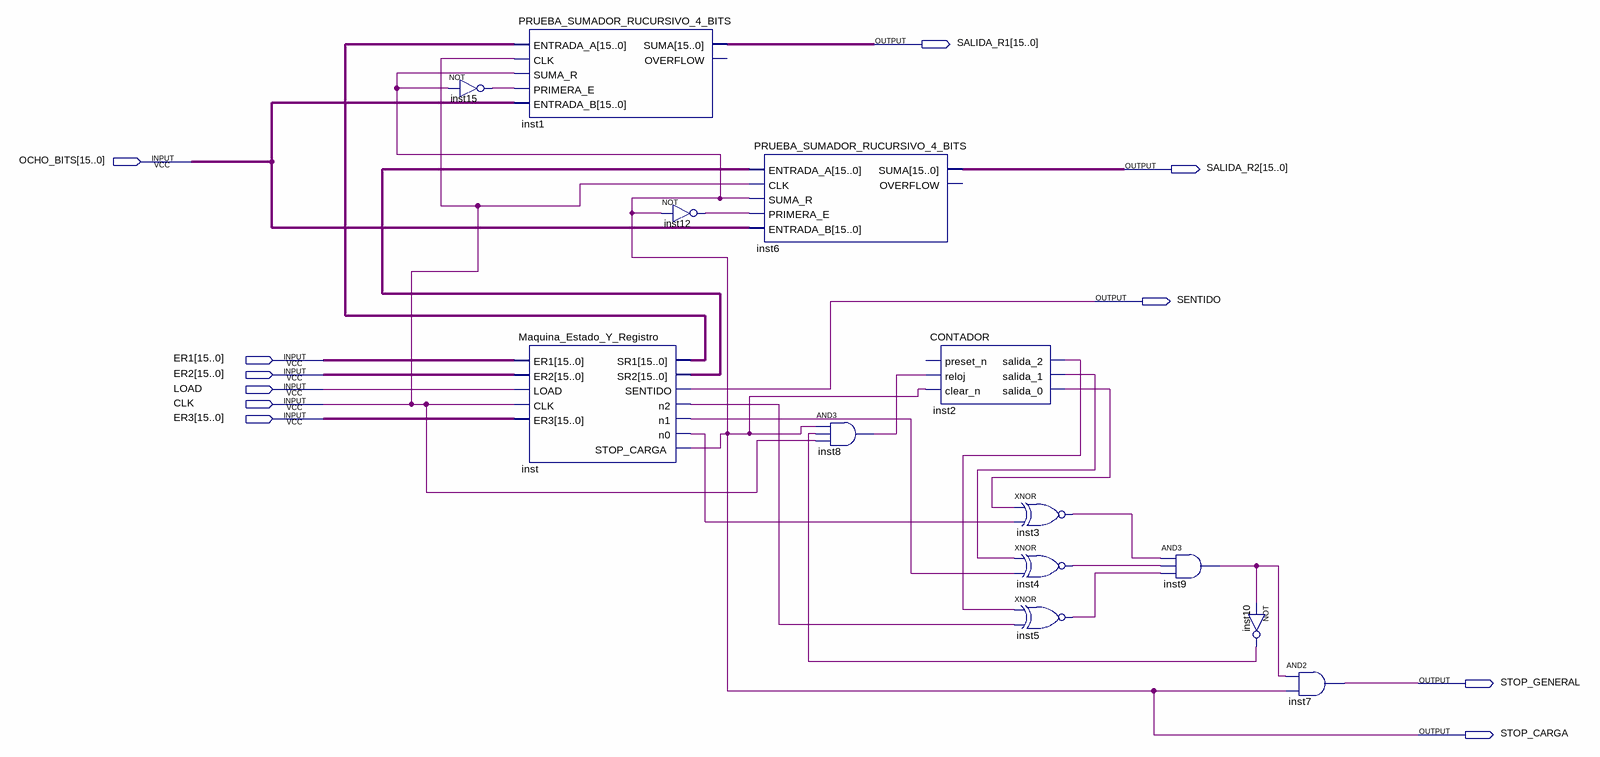
[diagram p0: schematic sheet]
// Quartus schematic ETAPAS_DE_TRANSMISION.bdf as structural Verilog: 13 symbols, 11 pins
module ETAPAS_DE_TRANSMISION (
  input  [15:0] OCHO_BITS,
  input  [15:0] ER1,
  input  [15:0] ER2,
  input  LOAD,
  input  CLK,
  input  [15:0] ER3,
  output [15:0] SALIDA_R1,
  output [15:0] SALIDA_R2,
  output SENTIDO,
  output STOP_GENERAL,
  output STOP_CARGA
);

  wire inst2_salida_0, inst2_salida_1, inst2_salida_2, inst3_out, inst4_out, inst5_out, inst8_out, inst9_out,
       inst10_out, inst12_out, inst15_out, inst_n0, inst_n1, inst_n2;
  wire [15:0] inst_sr1, inst_sr2;

  not inst15 (inst15_out, STOP_CARGA);
  PRUEBA_SUMADOR_RUCURSIVO_4_BITS inst1 (
    .ENTRADA_A(inst_sr1), .CLK(CLK), .SUMA_R(STOP_CARGA), .PRIMERA_E(inst15_out), .ENTRADA_B(OCHO_BITS),
    .SUMA(SALIDA_R1));  // open: OVERFLOW
  Maquina_Estado_Y_Registro inst (
    .ER1(ER1), .ER2(ER2), .LOAD(LOAD), .CLK(CLK), .ER3(ER3), .SR1(inst_sr1), .SR2(inst_sr2),
    .SENTIDO(SENTIDO), .n2(inst_n2), .n1(inst_n1), .n0(inst_n0), .STOP_CARGA(STOP_CARGA));
  not inst12 (inst12_out, STOP_CARGA);
  PRUEBA_SUMADOR_RUCURSIVO_4_BITS inst6 (
    .ENTRADA_A(inst_sr2), .CLK(CLK), .SUMA_R(STOP_CARGA), .PRIMERA_E(inst12_out), .ENTRADA_B(OCHO_BITS),
    .SUMA(SALIDA_R2));  // open: OVERFLOW
  and inst8 (inst8_out, STOP_CARGA, inst10_out, CLK);
  CONTADOR inst2 (
    .reloj(inst8_out), .clear_n(STOP_CARGA), .salida_2(inst2_salida_2), .salida_1(inst2_salida_1),
    .salida_0(inst2_salida_0));  // open: preset_n
  xnor inst3 (inst3_out, inst2_salida_0, inst_n0);
  xnor inst4 (inst4_out, inst2_salida_1, inst_n1);
  xnor inst5 (inst5_out, inst2_salida_2, inst_n2);
  and inst9 (inst9_out, inst3_out, inst4_out, inst5_out);
  not inst10 (inst10_out, inst9_out);
  and inst7 (STOP_GENERAL, inst9_out, STOP_CARGA);
endmodule
